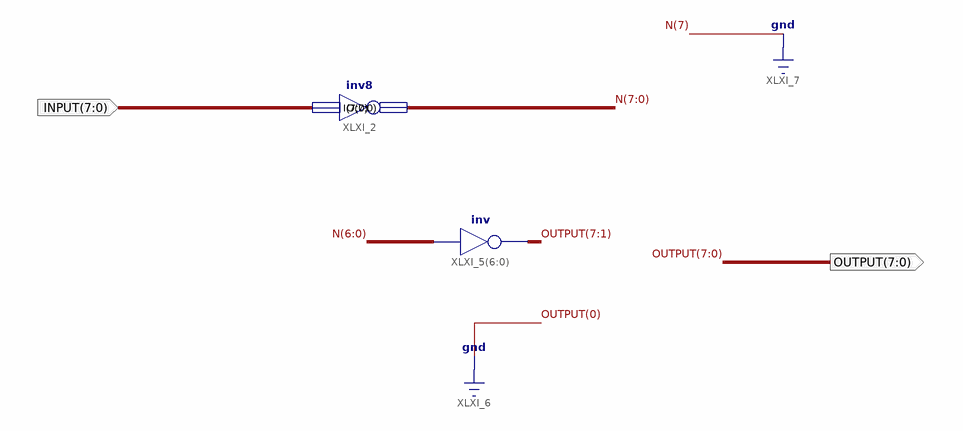
[diagram p0: schematic sheet 1]
// Xilinx ISE schematic SHIFTBIT.sch (spartan6) as structural Verilog: 2 symbols, 2 ports
module SHIFTBIT (
  input  [7:0] INPUT,
  output [7:0] OUTPUT
);

  wire [7:0] N;

  inv8 XLXI_2 (.I(INPUT), .O(N));
  assign OUTPUT[7:1] = ~N[6:0];  // inv XLXI_5[6..0], 7 bits wide

  assign OUTPUT[0] = 1'b0;
  // also tied to GND on the sheet: N[7]
endmodule
